# Altium schematic sheet Sheet1.SchDoc
size A4; SheetNumber: 1; SheetTotal: 1
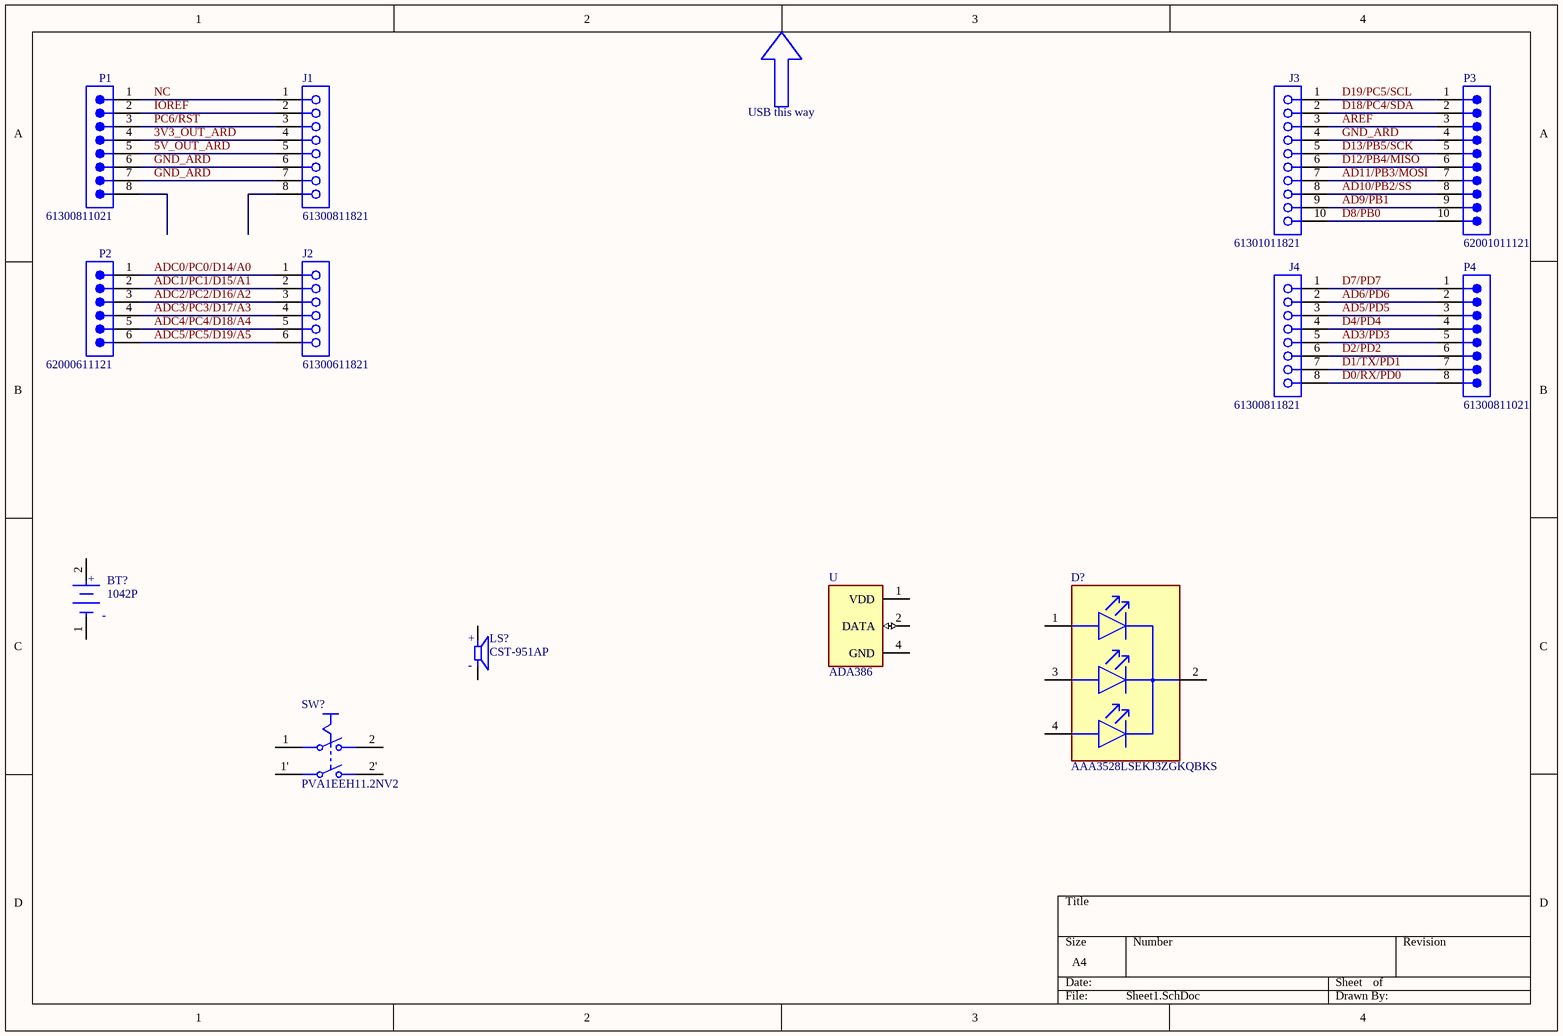
[diagram p0: Sheet1.SchDoc]

## Parts
BT?  1042P  [FP-1042P-MFG]
D?  AAA3528LSEKJ3ZGKQBKS  [FP-AAA3528LSEKJ3ZGKQBKS-MFG]
J1  61300811821  [61300811821]
J2  61300611821  [61300611821]
J3  61301011821  [61301011821]
J4  61300811821  [61300811821]
LS?  CST-951AP  [CUI_CST-951AP]
P1  61300811021  [61300811021]
P2  62000611121  [62000611121]
P3  62001011121  [62001011121]
P4  61300811021  [61300811021]
SW?  PVA1EEH11.2NV2  [FP-PVA1EEH11_2NV2-MFG]
U  ADA386  [XDCR_ADA386]

## Nets
3V3_OUT_ARD: J1.4 P1.4
5V_OUT_ARD: J1.5 P1.5
AD3/PD3: J4.5 P4.5
AD5/PD5: J4.3 P4.3
AD6/PD6: J4.2 P4.2
AD9/PB1: J3.9 P3.9
AD10/PB2/SS: J3.8 P3.8
AD11/PB3/MOSI: J3.7 P3.7
ADC0/PC0/D14/A0: J2.1 P2.1
ADC1/PC1/D15/A1: J2.2 P2.2
ADC2/PC2/D16/A2: J2.3 P2.3
ADC3/PC3/D17/A3: J2.4 P2.4
ADC4/PC4/D18/A4: J2.5 P2.5
ADC5/PC5/D19/A5: J2.6 P2.6
AREF: J3.3 P3.3
D0/RX/PD0: J4.8 P4.8
D1/TX/PD1: J4.7 P4.7
D2/PD2: J4.6 P4.6
D4/PD4: J4.4 P4.4
D7/PD7: J4.1 P4.1
D8/PB0: J3.10 P3.10
D12/PB4/MISO: J3.6 P3.6
D13/PB5/SCK: J3.5 P3.5
D18/PC4/SDA: J3.2 P3.2
D19/PC5/SCL: J3.1 P3.1
GND_ARD: J1.6 J1.7 J3.4 P1.6 P1.7 P3.4
IOREF: J1.2 P1.2
NC: J1.1 P1.1
PC6/RST: J1.3 P1.3

Not connected (* = marked no-connect by the designer): BT? 1(C) 2(A); D? 1(ANODE_RED) 2(COMMON_CATHODE) 3(ANODE_GREEN) 4(ANODE_BLUE); J1 8; LS? M P; P1 8; SW? 1 1' 2 2'; U 1(VDD) 2(DATA) 4(GND)

## Notes on the sheet
- USB this way
- (in symbol CMP-19636-000019-1) +; -
- (in symbol CST-951AP) +; -

## Library data of the parts
BT? = CMP-19636-000019-1: BATTERY HOLDER 18650 SMD TAB; Number of Cells: 1; Max Operating Temperature: 145°C; Termination: SMD/SMT; Mount: Surface Mount; Min Operating Temperature: -50°C; Package Quantity: 200; Packaging: Tray; Lead Free: Lead Free
D? = CMP-44529-000057-1: LED RGB CLEAR 4SMD; Forward Voltage: 2.7V; Lens Color: Colorless; Luminous Intensity: 30mcd; Viewing Angle: 120°; Color: Blue; Test Current: 2mA; Dominant Wavelength: 465nm; Packaging: Tape and Reel; Width: 2.8mm; Height: 2.1mm; Lens Transparency: Clear; Mount: Surface Mount; Case/Package: PLCC; Length: 3.2mm; RoHS Compliant: Yes
J1 J4 = CMP-1502-01327-4: Btb Conn, Rcpt, 8Pos, 1Row, 2.54Mm Rohs Compliant: Yes; Contact Resistance: 20mΩ; Gender: Female; Current Rating: 3A; Operating Supply Voltage: 250V; Number of Pins: 8; Lead Pitch: 2.54mm; Orientation: Vertical; RoHS: Non-Compliant
J2 = CMP-1502-01322-4: THT Vertical Socket Header WR-PHD, Pitch 2.54 mm, Single Row, 6 pins; Current Rating: 3A; Contact Resistance: 20mΩ; Gender: Female; Operating Supply Voltage: 250V; RoHS: Compliant; Orientation: Vertical; Number of Pins: 6; Lead Pitch: 2.54mm
J3 = CMP-1502-01332-4: THT Vertical Socket Header WR-PHD, Pitch 2.54 mm, Single Row, 10 pins; Contact Resistance: 20mΩ; Connector Type: Header, Socket; Gender: Female; Number of Positions: 10; Pitch: 2.54mm; Operating Supply Voltage: 250V; Insulation Resistance: 1GΩ; Current Rating: 3A; Insulation: Insulated; Color: Black; Mount: Through Hole; Length: 25.9mm; Lead Free: Lead Free; Number of Rows: 1; Contact Gender: Female; Max Operating Temperature: 125°C; Voltage Rating: 250V; Number of Contacts: 10; Width: 25.9mm; Flammability Rating: UL94 V-0; Orientation: Vertical; Housing Material: PBT; Lead Pitch: 2.54mm; Number of Pins: 10; RoHS: Compliant; Contact Material: Copper; Termination: Through Hole; Contact Plating: Gold; Height: 8.5mm; Min Operating Temperature: -40°C
LS? = CST-951AP: 9 mm, 5 V, 85 dB, Through Hole, Magnetic Audio Transducer Buzzer; MF: Same Sky; SnapEDA_Link: https://www.snapeda.com/parts/CST-951AP/Same+Sky/view-part/?ref=snap; Package: None; Value: *; MP: CST-951AP; Check_prices: https://www.snapeda.com/parts/CST-951AP/Same+Sky/view-part/?ref=eda
P1 P4 = CMP-1502-01075-4: THT Angled Pin Header WR-PHD, Pitch 2.54 mm, Single Row, 8 pins; Operating Supply Voltage: 250V; Number of Positions: 8; Contact Resistance: 20mΩ; Gender: Male; Current Rating: 3A; Pitch: 2.54mm; Connector Type: Male Pin; Lead Pitch: 2.54mm; Termination: Solder; Number of Rows: 1; Number of Pins: 8; Number of Contacts: 8; Contact Plating: Gold; Contact Mating Length: 5.9944mm; Color: Black; RoHS: Compliant; Contact Material: Copper; Packaging: Bulk; Mount: Through Hole
P2 = CMP-1502-00960-4: THT Vertical Pin Header WR-PHD, Pitch 2.00 mm, Single Row, 6 pins; Gender: Male; Contact Resistance: 20mΩ; Current Rating: 2A; Operating Supply Voltage: 200V; Lead Pitch: 2mm; Orientation: Vertical; Number of Pins: 6; RoHS: Non-Compliant
P3 = CMP-1502-00964-4: THT Vertical Pin Header WR-PHD, Pitch 2.00 mm, Single Row, 10 pins; Gender: Male; Current Rating: 2A; Operating Supply Voltage: 200V; Contact Resistance: 20mΩ; Lead Pitch: 2mm; Number of Pins: 10; Orientation: Vertical; RoHS: Non-Compliant
SW? = CMP-10035-000009-1: SWITCH PUSH DPST 0.1A 32V; Switch Function: Off-On; Current Rating: 100mA; Electrical Life: 100000Cycles; RoHS Compliant: Yes; Throw Configuration: DPST; Max Operating Temperature: 85°C; Voltage Rating (DC): 32V; Mount: Through Hole; Series: PVA; Min Operating Temperature: -40°C; Termination: PC Pin; Packaging: Bulk
U = ADA386: MF: Adafruit Industries; Value: *; Package: None; MP: ADA386; SnapEDA_Link: https://www.snapeda.com/parts/ADA386/Adafruit%20Industries/view-part/106068/?ref=snap; Price: None; Availability: Unavailable